# EAGLE design pcbgrado (EAGLE 9.6.2)
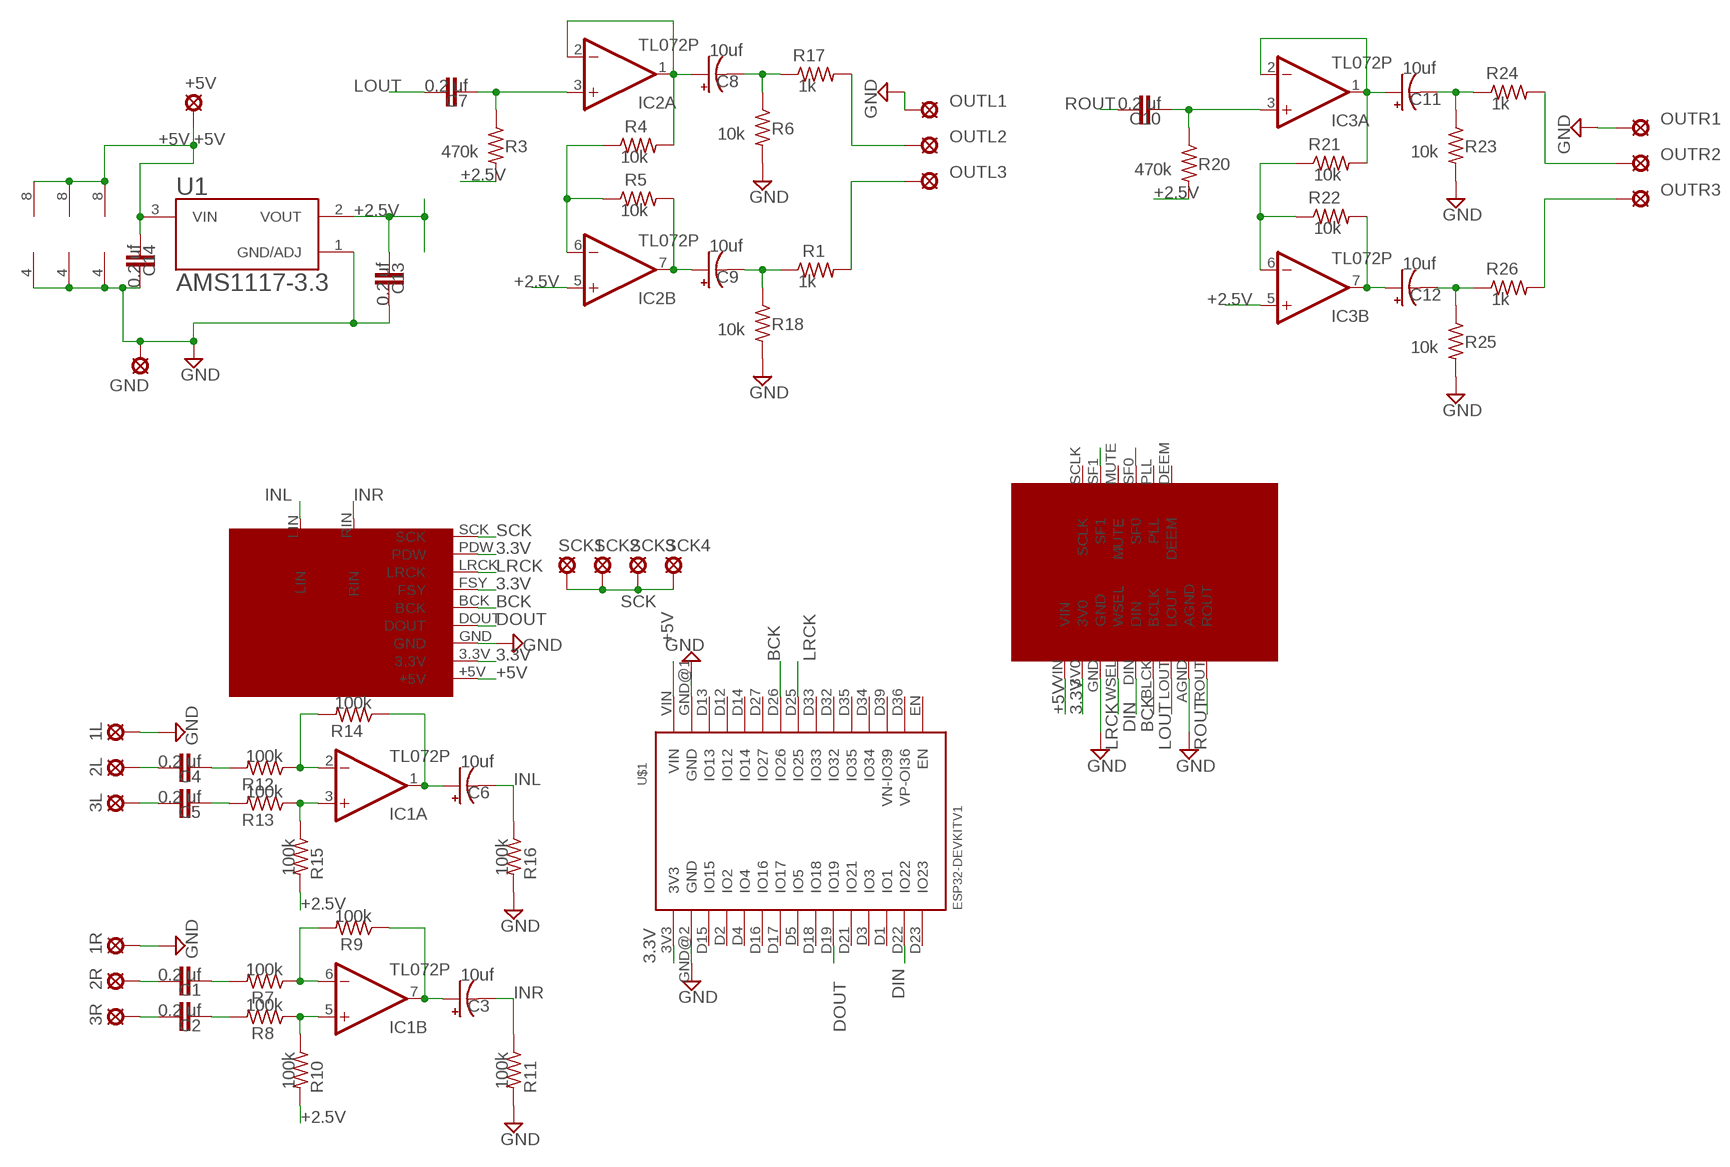
[diagram p0: schematic, sheet 1]

## Parts
1L  LSP10  [LSP10]
1R  LSP10  [LSP10]
2L  LSP10  [LSP10]
2R  LSP10  [LSP10]
3L  LSP10  [LSP10]
3R  LSP10  [LSP10]
+5V  LSP10  [LSP10]
C1  C-EU025-025X050  [C025-025X050]
C2  C-EU025-025X050  [C025-025X050]
C3  CPOL-USE1.8-4  [E1,8-4]
C4  C-EU025-025X050  [C025-025X050]
C5  C-EU025-025X050  [C025-025X050]
C6  CPOL-USE1.8-4  [E1,8-4]
C7  C-EU025-030X050  [C025-030X050]
C8  CPOL-USE1.8-4  [E1,8-4]
C9  CPOL-USE1.8-4  [E1,8-4]
C10  C-EU025-030X050  [C025-030X050]
C11  CPOL-USE1.8-4  [E1,8-4]
C12  CPOL-USE1.8-4  [E1,8-4]
C13  C-EU025-025X050  [C025-025X050]
C14  C-EU025-025X050  [C025-025X050]
GND  LSP10  [LSP10]
IC1  TL072P  [DIL08]
IC2  TL072P  [DIL08]
IC3  TL072P  [DIL08]
OUTL1  LSP10  [LSP10]
OUTL2  LSP10  [LSP10]
OUTL3  LSP10  [LSP10]
OUTR1  LSP10  [LSP10]
OUTR2  LSP10  [LSP10]
OUTR3  LSP10  [LSP10]
R1  R-US_0204/7  [0204/7]
R3  R-US_0204/7  [0204/7]
R4  R-US_0204/7  [0204/7]
R5  R-US_0204/7  [0204/7]
R6  R-US_0204/7  [0204/7]
R7  R-US_0204/7  [0204/7]
R8  R-US_0204/7  [0204/7]
R9  R-US_0204/7  [0204/7]
R10  R-US_0204/7  [0204/7]
R11  R-US_0204/7  [0204/7]
R12  R-US_0204/7  [0204/7]
R13  R-US_0204/7  [0204/7]
R14  R-US_0204/7  [0204/7]
R15  R-US_0204/7  [0204/7]
R16  R-US_0204/7  [0204/7]
R17  R-US_0204/7  [0204/7]
R18  R-US_0204/7  [0204/7]
R20  R-US_0204/7  [0204/7]
R21  R-US_0204/7  [0204/7]
R22  R-US_0204/7  [0204/7]
R23  R-US_0204/7  [0204/7]
R24  R-US_0204/7  [0204/7]
R25  R-US_0204/7  [0204/7]
R26  R-US_0204/7  [0204/7]
SCK1  LSP10  [LSP10]
SCK2  LSP10  [LSP10]
SCK3  LSP10  [LSP10]
SCK4  LSP10  [LSP10]
U1  AMS1117-3.3  [SOT229P700X180-4N]
U$1  ESP32DEVKITV1  [ESP32-DEVKITV1]
U$2  PCM1802DIS  [PCM1802PC]
U$3  UDA1334A  [UDA1334A]

## Nets
1: C10.2 IC3.3(A:+IN) R20.1
2: C7.2 IC2.3(A:+IN) R3.1
3.3V: U$1.3V3 U$2.3.3V U$2.FSY U$2.PDW U$3.3V0
+2.5V: C13.2 IC2.5(B:+IN) IC3.5(B:+IN) R3.2 R10.2 R15.2 R20.2 U1.2(VOUT)
+5V: +5V.MP C14.2 IC1.8(P:V+) IC2.8(P:V+) IC3.8(P:V+) U1.3(VIN) U$1.VIN U$2.+5V U$3.VIN
BCK: U$1.D26(IO26) U$2.BCK U$3.BLCK(BCLK)
DIN: U$1.D22(IO22) U$3.DIN
DOUT: U$1.D19(IO19) U$2.DOUT
GND: 1L.MP 1R.MP C13.1 C14.1 GND.MP IC1.4(P:V-) IC2.4(P:V-) IC3.4(P:V-) OUTL1.MP OUTR1.MP R6.2 R11.2 R16.2 R18.2 R23.2 R25.2 U1.1(GND/ADJ) U$1.GND@1(GND) U$1.GND@2(GND) U$2.GND U$3.AGND U$3.GND
INL: C6.- R16.1 U$2.LIN
INR: C3.- R11.1 U$2.RIN
LOUT: C7.1 U$3.LOUT
LRCK: U$1.D25(IO25) U$2.LRCK U$3.WSEL
N$1: 2L.MP C4.1
N$2: 3L.MP C5.1
N$3: 2R.MP C1.1
N$4: C1.2 R7.2
N$5: IC2.6(B:-IN) R4.1 R5.1
N$6: C8.+ IC2.1(A:OUT) IC2.2(A:-IN) R4.2
N$7: C9.+ IC2.7(B:OUT) R5.2
N$8: C8.- R6.1 R17.1
N$9: 3R.MP C2.1
N$10: C2.2 R8.2
N$11: IC1.6(B:-IN) R7.1 R9.2
N$12: IC1.5(B:+IN) R8.1 R10.1
N$13: C3.+ IC1.7(B:OUT) R9.1
N$14: C5.2 R13.2
N$15: C4.2 R12.2
N$16: IC1.3(A:+IN) R13.1 R15.1
N$17: IC1.2(A:-IN) R12.1 R14.2
N$18: C6.+ IC1.1(A:OUT) R14.1
N$19: OUTL2.MP R17.2
N$20: C9.- R1.1 R18.1
N$21: OUTL3.MP R1.2
N$22: C11.+ IC3.1(A:OUT) IC3.2(A:-IN) R21.2
N$23: IC3.6(B:-IN) R21.1 R22.1
N$24: C12.+ IC3.7(B:OUT) R22.2
N$25: C11.- R23.1 R24.1
N$26: OUTR2.MP R24.2
N$27: C12.- R25.1 R26.1
N$28: OUTR3.MP R26.2
N$29: U$3.SF0
N$30: U$3.SF1
ROUT: C10.1 U$3.ROUT
SCK: SCK1.MP SCK2.MP SCK3.MP SCK4.MP U$2.SCK
Unconnected: U$1.D1(IO1) U$1.D2(IO2) U$1.D3(IO3) U$1.D4(IO4) U$1.D5(IO5) U$1.D12(IO12) U$1.D13(IO13) U$1.D14(IO14) U$1.D15(IO15) U$1.D16(IO16) U$1.D17(IO17) U$1.D18(IO18) U$1.D21(IO21) U$1.D23(IO23) U$1.D27(IO27) U$1.D32(IO32) U$1.D33(IO33) U$1.D34(IO34) U$1.D35(IO35) U$1.D36(VP-OI36) U$1.D39(VN-IO39) U$1.EN U$3.DEEM U$3.MUTE U$3.PLL U$3.SCLK

## Library data of the parts
1L 1R 2L 2R 3L 3R +5V GND OUTL1-OUTL3 OUTR1-OUTR3 SCK1-SCK4 = solpad:LSP10: SOLDER PAD drill 1.0 mm, distributor Buerklin, 12H555
C1 C2 C4 C5 C7 C10 C13 C14 = rcl:C-EU: CAPACITOR, European symbol; SPICEPREFIX: C
C3 C6 C8 C9 C11 C12 = rcl:CPOL-US: POLARIZED CAPACITOR, American symbol; SPICEPREFIX: C
IC1-IC3 = linear:TL072: OP AMP
R1 R3-R18 R20-R26 = rcl:R-US_: RESISTOR, American symbol; SPICEPREFIX: R
U1 = AMS1117-3.3:AMS1117-3.3: Check availability <https://pricing.snapeda.com/parts/AMS1117-3.3/Advanced%20Monolithic%20Systems/view-part?ref=eda>; AVAILABILITY: In Stock; DESCRIPTION: Sot223/Pkg 1-Amp 3.3-Volt Low Drop Out Voltage Regulatator; MF: Advanced Monolithic Systems; MP: AMS1117-3.3; PACKAGE: SOT-223 Seeed Technology; PRICE: None; PURCHASE-URL: https://pricing.snapeda.com/search/part/AMS1117-3.3/?ref=eda
U$1 = ESP32-DEVKITV1:ESP32DEVKITV1
U$2 = PCM1802SIM:PCM1802DIS
U$3 = uda1334a:UDA1334A

## Board
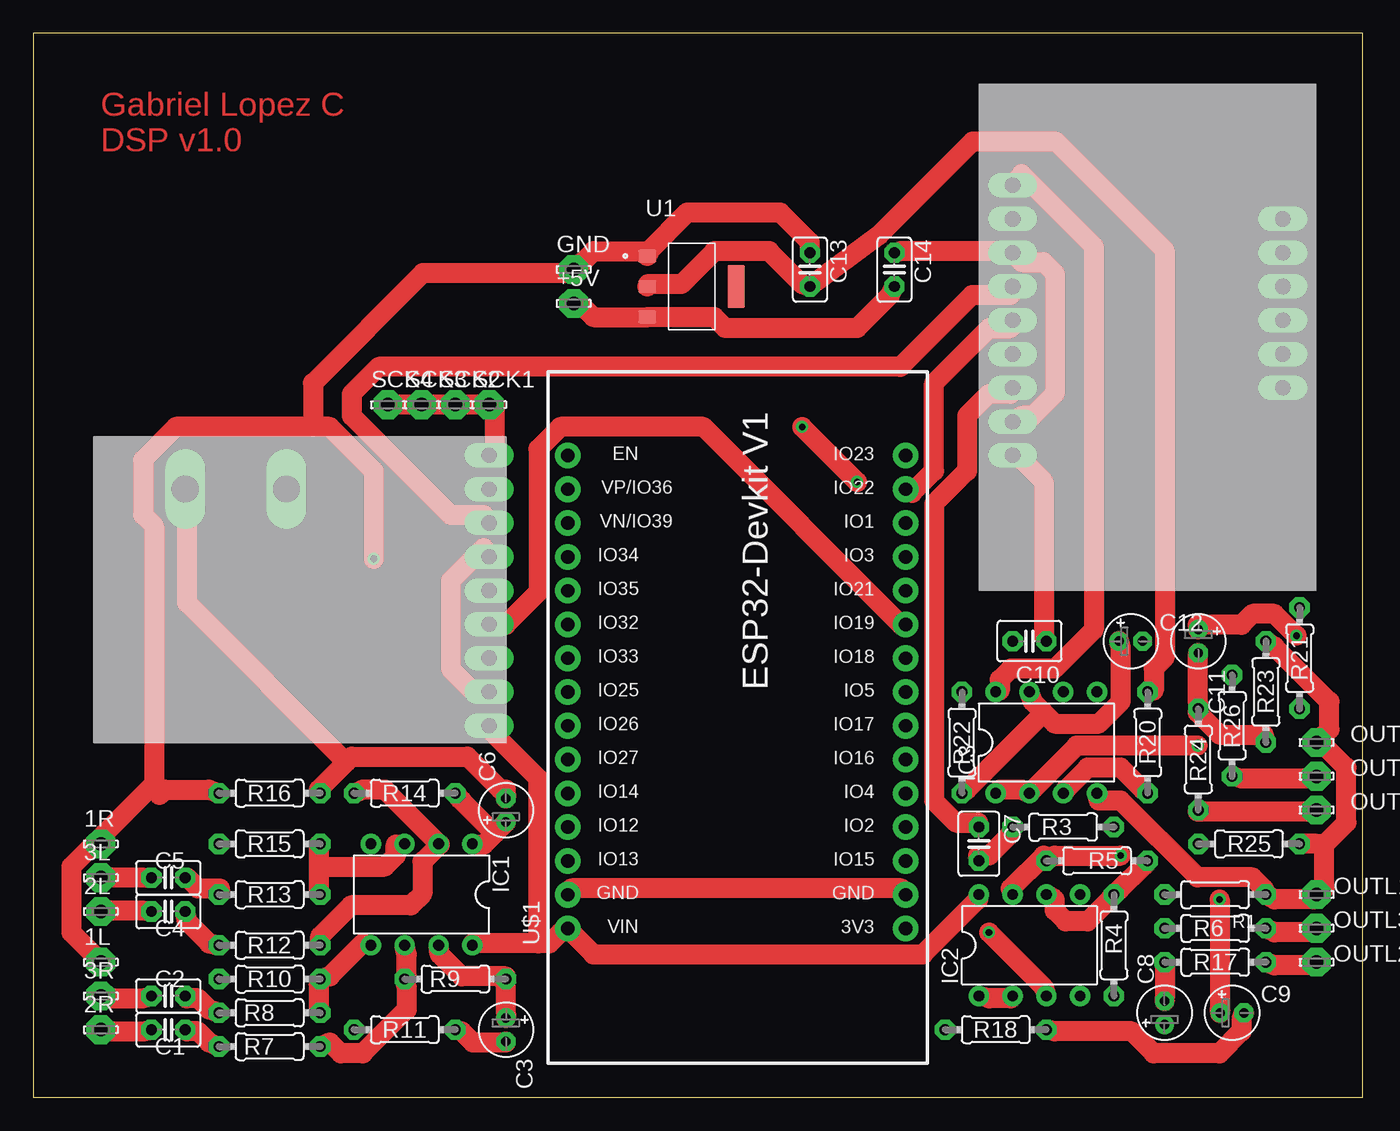
[diagram p1: board, top side]
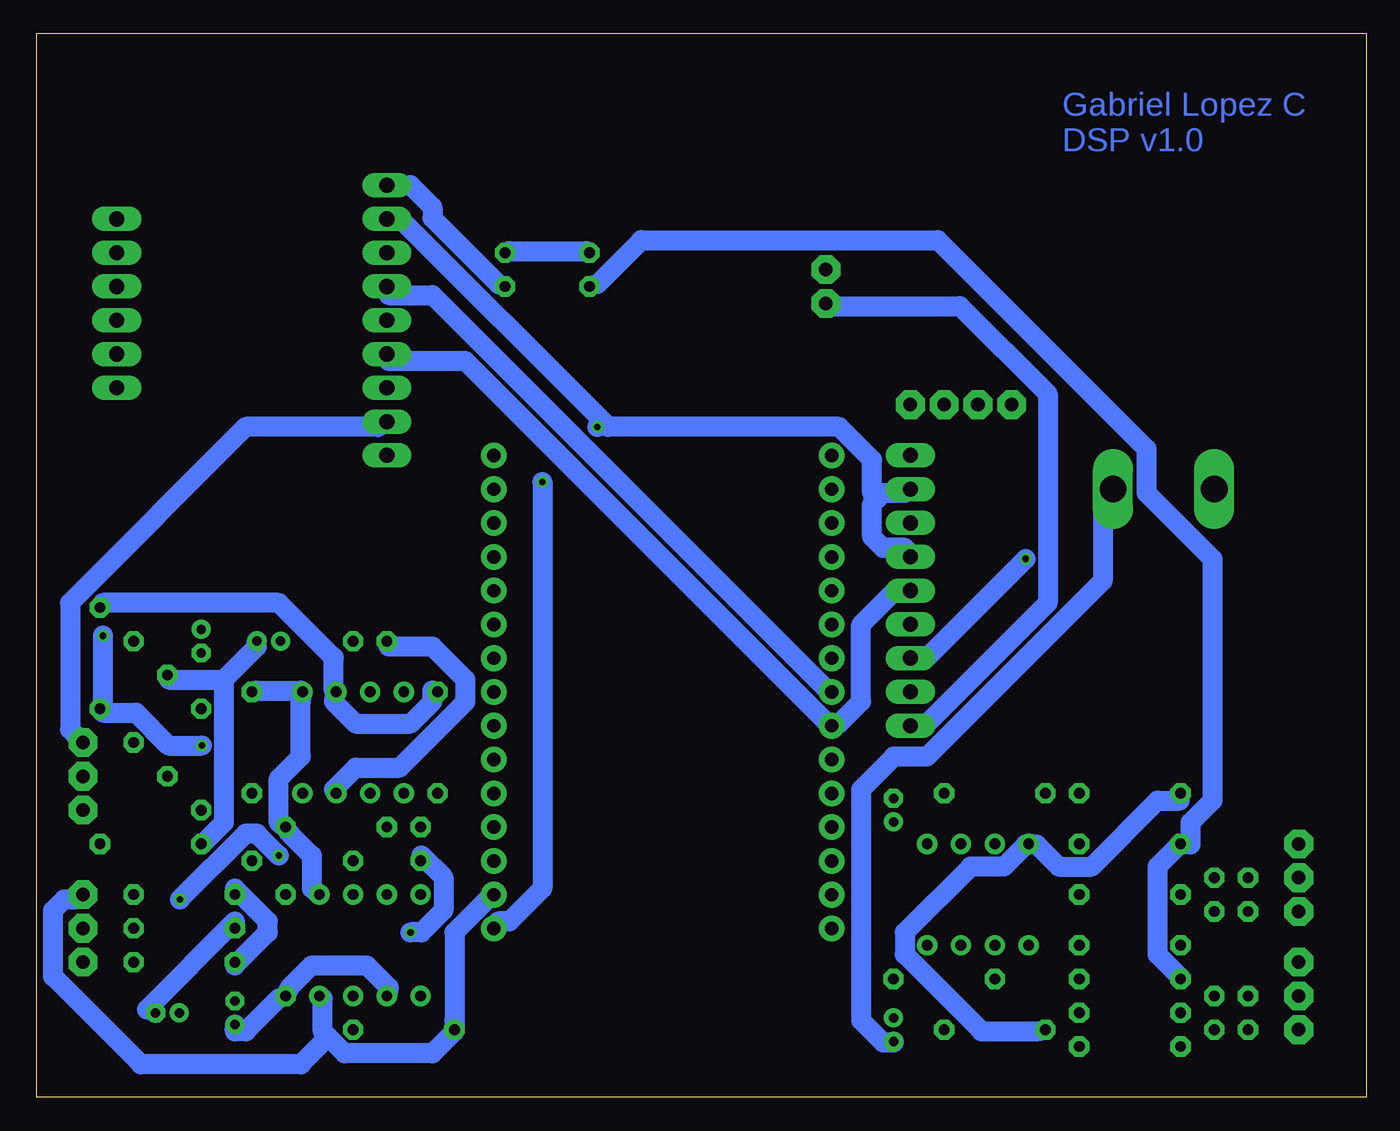
[diagram p2: board, bottom side, seen from below]

Size 100 x 80 mm. Coordinates in mm from the lower left corner, seen from the top.
Outline: 0,0 100,0 100,80 0,80 0,0
Copper layers (1*16): Top 0.035mm / dielectric 1.5mm / Bottom 0.035mm
Design rules "default *": minimum track width 1.5mm, minimum drill 0.5mm, track to track 6mil, track to pad 6mil, pad to pad 6mil, via to via 6mil, smd to smd 6mil, copper to edge 40mil, drill to drill 6mil, minimum pad ring 14mil, minimum via ring 8mil, stop-mask expansion 4mil, vias tented up to drill 0mil, thermal gap 10mil

### Footprints (pad centres in the part's own frame; a part is rotated, then mirrored left to right if it is on the bottom)
LSP10 = drill 1.016 pad 2.159 octagon: MP 0,0
C025-025X050 = drill 0.813 octagon: 1 -1.27,0; 2 1.27,0
E1,8-4 = drill 0.711 pad 1.168: + -0.889,0 | drill 0.711 pad 1.168 octagon: - 0.889,0
C025-030X050 = drill 0.813 octagon: 1 -1.27,0; 2 1.27,0
DIL08 = drill 0.813 pad 1.27: 1 -3.81,-3.81; 2 -1.27,-3.81; 3 1.27,-3.81; 4 3.81,-3.81; 5 3.81,3.81; 6 1.27,3.81; 7 -1.27,3.81; 8 -3.81,3.81
0204/7 = drill 0.813 octagon: 1 -3.81,0; 2 3.81,0
SOT229P700X180-4N = smd 1.31 x 0.93: 1 -3.345,2.29; 2 -3.345,0; 3 -3.345,-2.29 | smd 1.31 x 3.24: 4 3.345,0
ESP32-DEVKITV1 = drill 1 pad 1.93: 3V3 -16.52,-12.27; D1 13.96,-12.27; D2 -8.9,-12.27; D3 11.42,-12.27; D4 -6.36,-12.27; D5 1.26,-12.27; D12 -8.9,13.135; D13 -11.44,13.135; D14 -6.36,13.135; D15 -11.44,-12.27; D16 -3.82,-12.27; D17 -1.28,-12.27; D18 3.8,-12.27; D19 6.34,-12.27; D21 8.88,-12.27; D22 16.5,-12.27; D23 19.04,-12.27; D25 1.26,13.135; D26 -1.28,13.135; D27 -3.82,13.135; D32 6.34,13.135; D33 3.8,13.135; D34 11.42,13.135; D35 8.88,13.135; D36 16.5,13.135; D39 13.96,13.135; EN 19.04,13.135; GND@1 -13.98,13.135; GND@2 -13.98,-12.27; VIN -16.52,13.135
PCM1802PC = drill 1.143 long: 3.3V 15.24,-8.89; +5V 15.24,-11.43; BCK 15.24,-1.27; DOUT 15.24,-3.81; FSY 15.24,1.27; GND 15.24,-6.35; LRCK 15.24,3.81; PDW 15.24,6.35; SCK 15.24,8.89 | drill 2 long: LIN -7.62,6.35; RIN 0,6.35
UDA1334A = drill 1.143 long: 3V0 -8.89,-10.16; AGND 6.35,-10.16; BLCK 1.27,-10.16; DEEM 3.81,10.16; DIN -1.27,-10.16; GND -6.35,-10.16; LOUT 3.81,-10.16; MUTE -3.81,10.16; PLL 1.27,10.16; ROUT 8.89,-10.16; SCLK -8.89,10.16; SF0 -1.27,10.16; SF1 -6.35,10.16; VIN -11.43,-10.16; WSEL -3.81,-10.16

### Placement (x,y rotation side)
1L  5.08,10.16 0 top
1R  5.08,19.05 0 top
2L  5.08,13.97 0 top
2R  5.08,5.08 0 top
3L  5.08,16.51 0 top
3R  5.08,7.62 0 top
+5V  40.64,59.69 0 top
C1  10.16,5.08 0 top
C2  10.16,7.62 0 top
C3  35.56,5.08 270 top
C4  10.16,13.97 0 top
C5  10.16,16.51 0 top
C6  35.56,21.59 90 top
C7  71.12,19.05 270 top
C8  85.09,6.35 90 top
C9  90.17,6.35 0 top
C10  74.93,34.29 180 top
C11  87.63,34.29 270 top
C12  82.55,34.29 0 top
C13  58.42,62.23 270 top
C14  64.77,62.23 270 top
GND  40.64,62.23 0 top
IC1  29.21,15.24 180 top
IC2  74.93,11.43 0 top
IC3  76.2,26.67 0 top
OUTL1  96.52,15.24 0 top
OUTL2  96.52,10.16 0 top
OUTL3  96.52,12.7 0 top
OUTR1  96.52,26.67 0 top
OUTR2  96.52,21.59 0 top
OUTR3  96.52,24.13 0 top
R1  88.9,12.7 0 top
R3  77.47,20.32 0 top
R4  81.28,11.43 270 top
R5  80.01,17.78 180 top
R6  88.9,15.24 0 top
R7  17.78,3.81 180 top
R8  17.78,6.35 180 top
R9  31.75,8.89 180 top
R10  17.78,8.89 180 top
R11  27.94,5.08 180 top
R12  17.78,11.43 180 top
R13  17.78,15.24 180 top
R14  27.94,22.86 180 top
R15  17.78,19.05 180 top
R16  17.78,22.86 180 top
R17  88.9,10.16 0 top
R18  72.39,5.08 180 top
R20  83.82,26.67 90 top
R21  95.25,33.02 270 top
R22  69.85,26.67 270 top
R23  92.71,30.48 90 top
R24  87.63,25.4 270 top
R25  91.44,19.05 0 top
R26  90.17,27.94 270 top
SCK1  34.29,52.07 0 top
SCK2  31.75,52.07 0 top
SCK3  29.21,52.07 0 top
SCK4  26.67,52.07 0 top
U1  49.53,60.96 0 top
U$1  53.34,29.21 90 top
U$2  19.05,39.37 0 top
U$3  83.82,57.15 270 top

### Tracks (layer width: path | path; a pad name or v marks a point on that pad's centre or on a via)
1
  Top 1.5: IC3.3 77.66,23.13 79.31,24.79 81.79,24.79 83.45,23.13 R20.1
  Bottom 1.5: C10.2 73.53,33.87 70.23,33.87 67.75,31.4 67.75,29.74 72.71,24.79 76.01,24.79 77.66,23.13 IC3.3
2  (via drill 0.5)
  Top 1.5: C7.2 71.05,18.18 71.88,18.18 73.53,19.83 R3.1 | v71.88,12.39 76.01,8.26 IC2.3
  Bottom 1.5: v71.88,12.39 71.05,12.39 69.4,14.04 69.4,16.52 71.05,18.18 C7.2
3.3V  (via drill 0.5)
  Top 1.5: U$2.3.3V 33.87,30.57 33.05,30.57 31.4,32.22 31.4,38.83 33.87,41.31 U$2.FSY | v57.83,50.4 v61.97,46.27
  Bottom 1.5: 36.77,45.03 37.18,44.62 37.18,42.14 36.35,41.31 34.7,41.31 U$2.FSY | 36.77,45.03 36.35,45.44 34.7,45.44 U$2.PDW | 57.42,50.81 57.01,50.4 39.66,50.4 37.18,47.92 37.18,45.44 36.77,45.03 | 57.42,50.81 72.71,66.1 73.53,66.1 U$3.3V0 | v61.97,46.27 61.97,15.7 64.44,13.22 65.27,13.22 U$1.3V3 | v57.83,50.4 57.42,50.81
+2.5V
  Top 1.5: U1.2 46.27,61.14 48.75,61.14 51.22,63.62 55.35,63.62 57.83,61.14 C13.2 63.63,64.84 70.67,71.88 76.9,71.88 85.1,63.68 85.1,33.05 84.27,32.22 84.27,30.57 R20.2
  Bottom 1.5: R20.2 83.45,30.57 80.14,30.57 IC3.5 80.14,29.74 80.14,25.61 81.79,23.96 81.79,20.66 R3.2 80.97,19.83 79.31,18.18 79.31,15.7 IC2.5 | R10.2 14.04,9.09 15.7,10.74 15.7,17.35 14.04,19 R15.2 13.22,19 13.22,20.66 11.57,22.31 11.57,40.48 16.52,45.44 16.52,48.75 32.22,64.44 54.53,64.44 57.83,61.14 C13.2
+5V
  Top 1.5: 38.01,11.57 38.83,11.57 39.66,12.39 U$1.VIN 40.48,12.39 42.14,10.74 66.92,10.74 71.05,14.87 IC2.8 | 38.01,11.57 33.05,11.57 IC1.8 | 38.01,11.57 38.01,23.96 34.7,27.27 U$2.+5V | 46.27,58.66 42.14,58.66 41.31,59.49 +5V.MP | IC3.8 72.71,30.57 72.71,31.4 73.53,32.22 76.84,32.22 79.76,35.14 79.76,64 74.36,69.4 U$3.VIN | 46.27,58.66 51.22,58.66 52.05,57.83 61.97,57.83 64.44,60.31 C14.2 | 46.27,58.66 U1.3
  Bottom 1.5: C14.2 65.27,61.14 70.23,66.1 70.23,66.92 71.88,68.58 73.53,68.58 U$3.VIN | U$2.+5V 33.87,28.09 33.05,28.09 23.96,37.18 23.96,52.88 30.57,59.49 40.48,59.49 +5V.MP
BCK
  Bottom 1.5: U$2.BCK 34.7,38.01 35.53,38.01 38.01,35.53 38.01,29.74 39.66,28.09 U$1.D26 40.48,28.09 67.75,55.35 73.53,55.35 U$3.BLCK
DIN
  Top 1.5: U$3.DIN 73.53,57.83 71.88,57.83 67.75,53.7 67.75,47.09 66.1,45.44 U$1.D22
DOUT
  Top 1.5: U$2.DOUT 34.7,35.53 35.53,35.53 38.01,38.01 38.01,48.75 39.66,50.4 50.4,50.4 65.27,35.53 U$1.D19
GND  (via drill 0.5)
  Top 1.5: R23.2 93.36,33.87 97.49,29.74 97.49,27.65 97.11,27.27 OUTR1.MP 97.11,26.44 98.76,24.79 98.76,20.66 97.11,19 | IC3.4 80.14,22.31 81.79,22.31 87.58,16.52 91.71,16.52 92.53,15.7 R6.2 93.36,14.87 96.28,14.87 OUTL1.MP 97.11,15.7 97.11,19 | 97.11,19 96.52,19.05 R25.2 | U$1.GND@1 40.48,15.7 65.27,15.7 U$1.GND@2 | R16.2 13.22,23.13 9.91,23.13 9.5,22.72 9.09,23.13 | 1L.MP 4.51,10.74 2.86,12.39 2.86,17.35 4.51,19 1R.MP 5.34,19.83 9.09,23.58 9.09,42.96 8.26,43.79 8.26,47.92 10.74,50.4 21.04,50.4 | U$3.AGND 74.36,51.22 75.18,51.22 76.84,52.88 76.84,61.97 76.01,62.79 74.36,62.79 U$3.GND 73.53,63.62 65.27,63.62 C14.1 | 46.27,63.62 42.14,63.62 41.31,62.79 GND.MP 40.48,61.97 29.3,61.97 21.04,53.7 21.04,50.4 | v25.61,40.48 25.61,47.09 22.31,50.4 21.04,50.4 | C13.1 58.42,64.3 56.18,66.54 49.19,66.54 46.27,63.62 | 46.27,63.62 U1.1
  Bottom 1.5: U$1.GND@2 66.1,14.87 68.58,12.39 68.58,5.78 R18.2 68.58,4.96 70.23,3.31 76.84,3.31 78.08,4.54 | 78.08,4.54 78.49,4.96 78.49,7.44 IC2.4 | 78.08,4.54 80.14,2.48 92.15,2.48 98.76,9.09 98.76,14.04 97.94,14.87 97.11,14.87 OUTL1.MP | R11.2 24.79,4.96 28.92,4.96 34.7,10.74 34.7,12.39 29.74,17.35 27.27,17.35 25.61,19 IC1.4 24.79,19 23.13,17.35 20.66,17.35 15.7,22.31 14.04,22.31 R16.2 | C13.1 58.66,63.62 64.44,63.62 C14.1 | v25.61,40.48 33.05,33.05 33.87,33.05 U$2.GND | OUTR1.MP 97.11,27.27 97.49,27.65 97.49,37.18 84.27,50.4 74.36,50.4 U$3.AGND
INL
  Top 1.5: 23.55,25.2 21.48,23.13 R16.1 | 23.55,25.2 23.96,25.61 32.67,25.61 35.14,23.13 35.53,23.13 C6.- | 23.55,25.2 11.57,37.18 11.57,45.44 U$2.LIN
INR
  Top 1.5: C3.- 35.53,4.13 33.05,4.13 32.22,4.96 R11.1
  Bottom 1.5: C3.- 35.53,4.13 36.35,4.13 38.01,5.78 38.01,23.13 35.53,25.61 33.05,25.61 19.83,38.83 19.83,45.44 U$2.RIN
LOUT
  Top 1.5: C7.1 71.05,20.66 69.4,20.66 67.75,22.31 67.75,44.62 70.23,47.09 70.23,51.22 71.88,52.88 73.53,52.88 U$3.LOUT
LRCK
  Top 1.5: U$2.LRCK 33.87,43.79 31.4,43.79 23.96,51.22 23.96,52.88 26,54.91 65.21,54.91 70.61,60.31 73.53,60.31 U$3.WSEL
  Bottom 1.5: U$1.D25 40.48,30.57 70.23,60.31 73.53,60.31 U$3.WSEL
N$1
  Top 1.5: C4.1 8.26,14.04 5.34,14.04 2L.MP
N$2
  Top 1.5: C5.1 8.26,16.52 5.34,16.52 3L.MP
N$3
  Top 1.5: C1.1 8.26,4.96 5.34,4.96 2R.MP
N$4
  Top 1.5: C1.2 11.57,4.96 12.39,4.96 13.22,4.13 R7.2
N$5
  Top 1.5: IC2.6 76.84,14.87 76.84,14.04 77.66,13.22 79.31,13.22 80.97,14.87 R4.1 81.79,15.7 83.45,17.35 R5.1
N$6
  Top 1.5: IC2.1 71.88,7.44 73.53,7.44 IC2.2
  Bottom 1.5: C8.+ 85.1,4.96 84.27,4.96 81.79,7.44 R4.2 80.97,8.26 79.31,9.91 75.18,9.91 73.53,8.26 IC2.2
N$7  (via drill 0.5)
  Top 1.5: v89.23,14.87 89.23,6.61 C9.+ | v81.79,18.18 76.84,18.18 R5.2 76.01,18.18 73.53,15.7 IC2.7
  Bottom 1.5: v89.23,14.87 84.27,19.83 83.45,19.83 v81.79,18.18
N$8
  Top 1.5: C8.- 85.1,7.44 85.1,9.91 R17.1
  Bottom 1.5: R6.1 85.1,15.7 82.62,13.22 82.62,12.39 85.1,9.91 R17.1
N$9
  Top 1.5: C2.1 8.26,7.44 5.34,7.44 3R.MP
N$10
  Top 1.5: C2.2 11.57,7.44 12.39,7.44 13.22,6.61 R8.2
N$11
  Top 1.5: R7.1 22.31,4.13 23.13,3.31 24.79,3.31 28.09,6.61 28.09,8.26 R9.2 28.09,9.09 28.09,10.74 IC1.6
N$12
  Top 1.5: R8.1 21.48,6.61 21.48,8.26 R10.1 22.31,9.09 24.79,11.57 IC1.5
N$13
  Top 1.5: C3.+ 35.53,6.61 35.53,8.26 R9.1 35.53,9.09 32.22,9.09 30.57,10.74 IC1.7
N$14
  Top 1.5: R13.2 14.04,15.7 12.39,15.7 11.57,16.52 C5.2
N$15
  Top 1.5: C4.2 11.57,13.22 13.22,11.57 R12.2
N$16
  Top 1.5: 21.48,17.35 21.48,19 R15.1 | 21.48,17.35 21.48,15.7 R13.1 | 21.48,17.35 26.44,17.35 27.27,18.18 27.27,19 IC1.3
N$17
  Top 1.5: R12.1 21.59,12.12 23.9,14.43 28.4,14.43 29.28,15.31 29.28,17.71 30.57,19 | 30.57,19 26.44,23.13 24.79,23.13 R14.2 | 30.57,19 IC1.2
N$18
  Top 1.5: 34.7,19.83 33.87,19 33.05,19 IC1.1 | 34.7,19.83 35.53,20.66 C6.+ | 34.7,19.83 32.22,22.31 R14.1
N$19
  Top 1.5: R17.2 93.36,9.91 96.28,9.91 OUTL2.MP
N$20
  Top 1.5: R18.1 76.84,4.96 82.62,4.96 84.27,3.31 89.23,3.31 90.88,4.96 90.88,5.78 C9.-
  Bottom 1.5: C9.- 91.71,6.61 85.1,13.22 R1.1
N$21
  Top 1.5: R1.2 93.36,12.39 96.28,12.39 OUTL3.MP
N$22  (via drill 0.5)
  Top 1.5: IC3.1 72.71,23.13 74.36,23.13 IC3.2 75.18,23.13 78.49,26.44 v87.58,26.44 | v95.01,34.7 93.36,36.35 91.71,36.35 90.88,35.53 87.58,35.53 C11.+
  Bottom 1.5: v95.01,34.7 95.01,29.74 R21.2 95.01,28.92 92.53,28.92 90.06,26.44 v87.58,26.44
N$23
  Bottom 1.5: R22.1 70.23,30.57 70.23,29.74 71.88,28.09 76.01,28.09 77.66,29.74 IC3.6 77.66,30.57 77.66,33.05 81.79,37.18 95.01,37.18 R21.1
N$24
  Top 1.5: 76.01,28.92 75.18,29.74 IC3.7 | 76.01,28.92 76.84,28.09 80.14,28.09 81.79,29.74 81.79,33.87 C12.+ | 76.01,28.92 70.23,23.13 R22.2
N$25
  Top 1.5: C11.- 87.58,33.05 87.58,29.74 R24.1 87.58,28.92 89.23,27.27 92.53,27.27 R23.1
N$26
  Top 1.5: R24.2 87.58,21.48 96.28,21.48 OUTR2.MP
N$27
  Bottom 1.5: 85.92,31.4 83.45,33.87 C12.- | 85.92,31.4 90.06,31.4 R26.1 | 85.92,31.4 85.92,20.66 87.58,19 R25.1
N$28
  Top 1.5: R26.2 90.88,23.96 96.28,23.96 OUTR3.MP
ROUT
  Top 1.5: C10.1 76.01,34.7 76.01,46.27 74.36,47.92 U$3.ROUT
SCK
  Top 1.5: SCK4.MP 27.27,52.05 28.92,52.05 SCK3.MP 29.74,52.05 31.4,52.05 SCK2.MP 32.22,52.05 33.87,52.05 SCK1.MP 34.7,52.05 34.7,48.75 U$2.SCK

### Text on the board
Top: Gabriel Lopez C / DSP v1.0
Bottom: Gabriel Lopez C / DSP v1.0